# EAGLE schematic bp_pic_programmer_v2 (EAGLE 5.11)
LEFT: 3V3; RIGHT: 5V
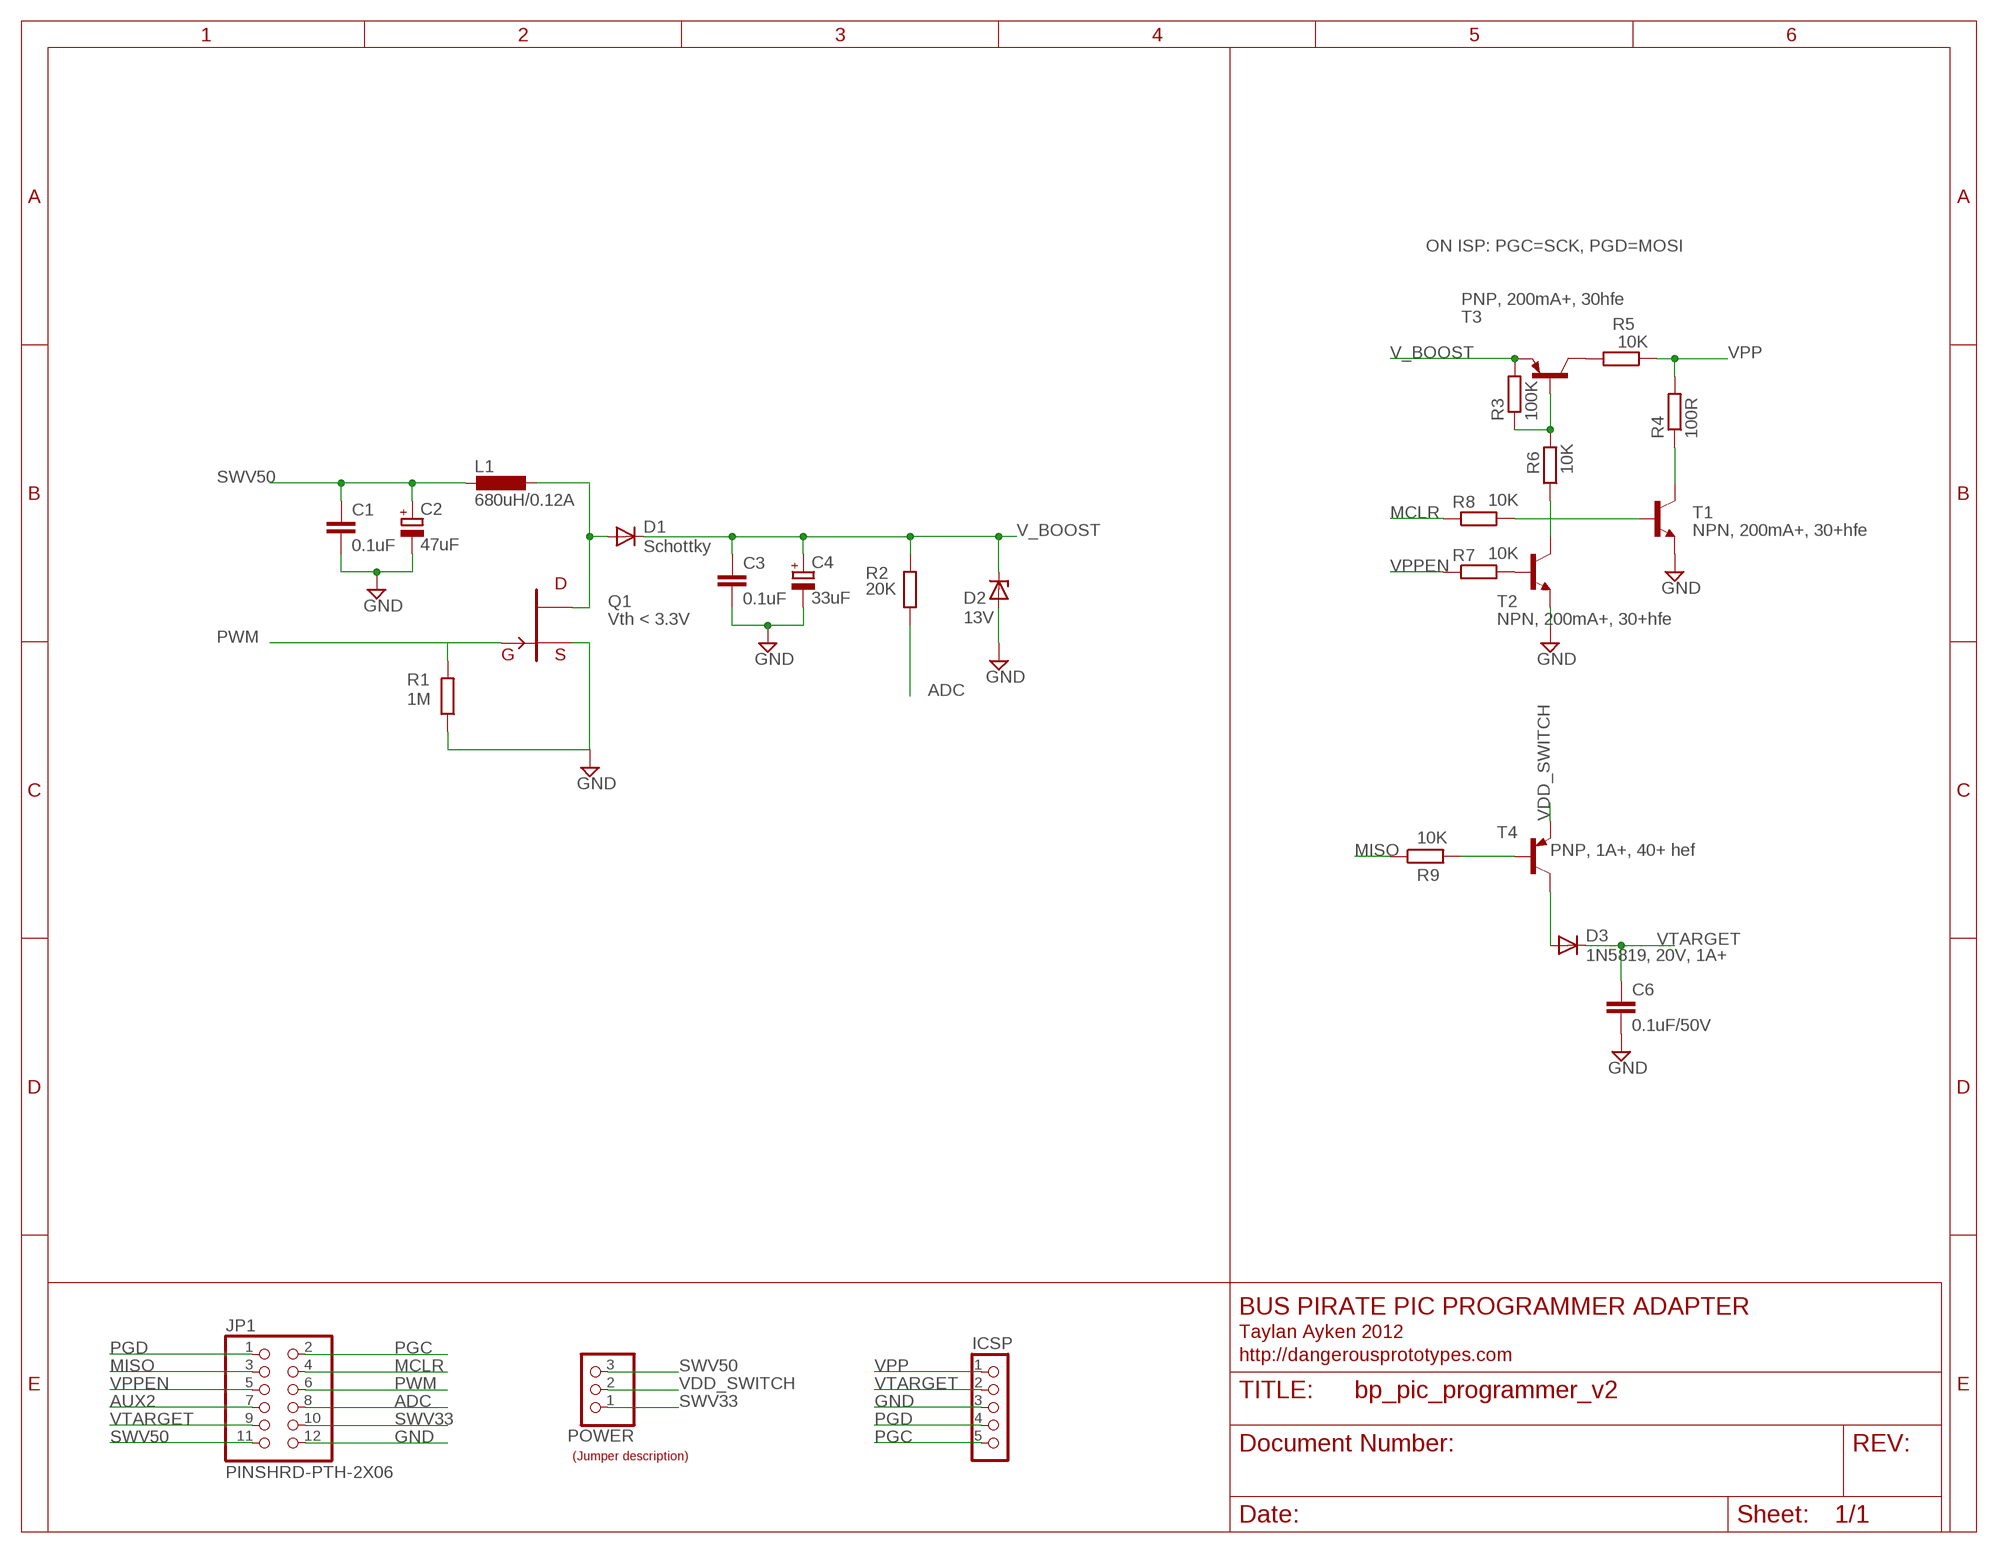
[diagram p0: schematic, sheet 1]

## Parts
C1  0.1uF  CAPC805  [C805]
C2  47uF  CAP_POLCASE_B  [CASE_B]
C3  0.1uF  CAPC805  [C805]
C4  33uF  CAP_POLCASE_B  [CASE_B]
C6  0.1uF/50V  C-EUC0805K  [C0805K]
D1  Schottky  DIODEDO323  [DO323]
D2  13V  ZENERSOD-323F  [SOD-323F]
D3  1N5819, 20V, 1A+  MBR0520LT  [SOD123]
ICSP  CON_HEADER_1X05-PTH  [M1X5]
JP1  PINSHRD-PTH-2X06  PINHD-2X6  [2X06]
L1  680uH/0.12A  L-EUL4532P  [L4532P]
POWER  PINHD-1X3  [1X03]
Q1  Vth < 3.3V  FET-N  [SOT23]
R1  1M  R-EU_M0805  [M0805]
R2  20K  R-EU_M0805  [M0805]
R3  100K  R-EU_M0805  [M0805]
R4  100R  R-EU_M0805  [M0805]
R5  10K  R-EU_M0805  [M0805]
R6  10K  R-EU_M0805  [M0805]
R7  10K  R-EU_M0805  [M0805]
R8  10K  R-EU_M0805  [M0805]
R9  10K  R-EU_M0805  [M0805]
T1  NPN, 200mA+, 30+hfe  NPNSOT23BEC  [SOT23-BEC]
T2  NPN, 200mA+, 30+hfe  NPNSOT23BEC  [SOT23-BEC]
T3  PNP, 200mA+, 30hfe  PNPSOT23BEC  [SOT23-BEC]
T4  PNP, 1A+, 40+ hef  PNPSOT23BEC  [SOT23-BEC]
U$1  JUMP3_DESC  [JUMP3_DESC]

## Nets
ADC: JP1.8 R2.1
AUX2: JP1.7
GND: C1.2 C2.- C3.2 C4.- C6.2 D2.A ICSP.3 JP1.12 Q1.2(S) R1.1 T1.E T2.E
MCLR: JP1.4 R8.1
MISO: JP1.3 R9.1
N$1: R9.2 T4.B
N$2: D1.A L1.1 Q1.3(D)
N$3: R4.1 T1.C
N$4: R5.2 T3.C
N$5: R6.1 T2.C
N$6: R3.1 R6.2 T3.B
N$7: R8.2 T1.B
N$8: R7.2 T2.B
N$10: D3.A T4.C
PGC: ICSP.5 JP1.2
PGD: ICSP.4 JP1.1
PWM: JP1.6 Q1.1(G) R1.2
SWV33: JP1.10 POWER.1
SWV50: C1.1 C2.+ JP1.11 L1.2 POWER.3
V_BOOST: C3.1 C4.+ D1.C D2.C R2.2 R3.2 T3.E
VDD_SWITCH: POWER.2 T4.E
VPP: ICSP.1 R4.2 R5.1
VPPEN: JP1.5 R7.1
VTARGET: C6.1 D3.C ICSP.2 JP1.9

## Notes on the sheet
- ON ISP: PGC=SCK, PGD=MOSI
- BUS PIRATE PIC PROGRAMMER ADAPTER
- Taylan Ayken 2012
- http://dangerousprototypes.com

## Library data of the parts
C1 C3 = dp_devices:CAP
C2 C4 = dp_devices:CAP_POL
C6 = rcl:C-EU: CAPACITOR, European symbol
D1 = dp_devices:DIODE
D2 = dp_devices:ZENER: Zener Diode SOD-323
D3 = diode:MBR0520LT: SCHOTTKY BARRIER RECTIFIER Source: http://onsemi.com .. MBR0520LT1-D.pdf
ICSP = dp_devices:CON_HEADER_1X05
JP1 = pinhead:PINHD-2X6: PIN HEADER
L1 = rcl:L-EU: INDUCTOR, European symbol
POWER = pinhead-2:PINHD-1X3: PIN HEADER
Q1 = dp_devices:FET-N
R1-R9 = rcl:R-EU_: RESISTOR, European symbol
T1 T2 = dp_devices:NPN
T3 T4 = dp_devices:PNP
U$1 = dp_devices:JUMP3_DESC: Nice formatted three legged jumperdescription Use attributes to change the values LEFT = With jumper to the left RIGHT = With jumper to the right; LEFT: left; RIGHT: right